# Altium project ife18_TS_BMS_LTC6813_v3.PrjPcb
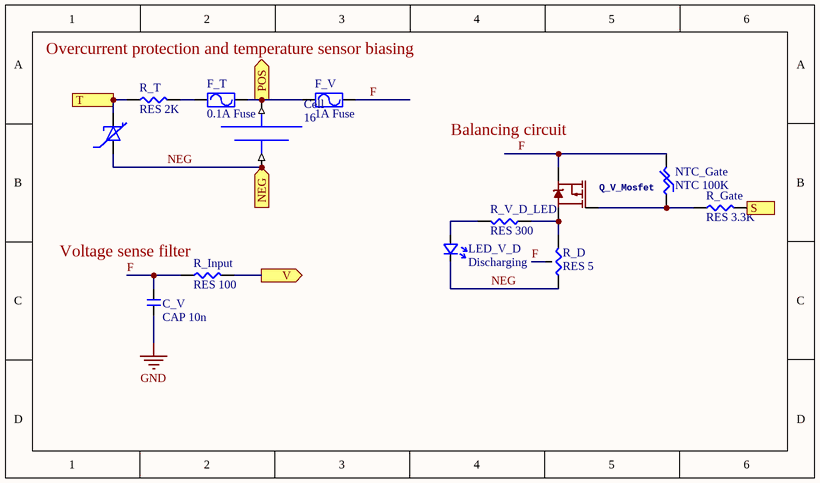
[diagram p0: Cell.SchDoc]
2 sheets, 71 parts. Net scope: hierarchical (ports join the sheet entries above them; power ports are global).
Board file: Even.PcbDoc
Sheets:
  Cell.SchDoc
  Slave.SchDoc

## Sheet Cell.SchDoc
size 152 x 88 mm

### Parts
C_V  CAP 10n  [CAP-0603]
Cell  16  [Li1x7pVTC6T_Clips]
F_T  0.1A Fuse  [2410SMD]
F_V  1A Fuse  [2410SMD]
LED_V_D  Discharging  [LED-0603]
NTC_Gate  NTC 100K  [NTC-0603]
Q_V_Mosfet  (no value)  [TO252]
R_D  RES 5  [TO252-TKH-45]
R_Gate  RES 3.3K  [RES-0603]
R_Input  RES 100  [RES-0603]
R_T  RES 2K  [RES-0603]
R_V_D_LED  RES 300  [RES-0603]

### Ports
NEG (in), POS (out), S (in), T (out), V (out)

### Nets
GND: C_V.1
F: C_V.2 F_V.1 NTC_Gate.2 Q_V_Mosfet.3(S) R_D.3 R_Input.1
NEG: Cell.- Cell.-L Cell.-O Cell.-R Cell.T- LED_V_D.K R_D.1 ; port NEG
NetCell_+: Cell.+ Cell.+L Cell.+O Cell.+R F_T.1 F_V.2 ; port POS
NetCell_T+: Cell.T+ R_T.1 ; port T
NetF_T_2: F_T.2 R_T.2
NetLED_V_D_A: LED_V_D.A R_V_D_LED.2
NetNTC_Gate_1: NTC_Gate.1 Q_V_Mosfet.1(G) R_Gate.1
NetQ_V_Mosfet_2: Q_V_Mosfet.2(D) R_D.2 R_V_D_LED.1
NetR_Gate_2: R_Gate.2 ; port S
NetR_Input_2: R_Input.2 ; port V

### Notes on the sheet
- Overcurrent protection and temperature sensor biasing
- (near Q_V_Mosfet) Balancing circuit
- (near R_Input) Voltage sense filter

### Library data of the parts
C_V = CAP-0603
Cell = Li1x7pVTC6T_Clip
F_T F_V = 0679L
LED_V_D = LED-0603
NTC_Gate = NTC-0603
Q_V_Mosfet = DMP10H400SK3-13: GateName_1: G$1; SymbolName_1: LABELED-PMOS; LibraryName: IFE_Transistors; DeviceSetName: DMP10H400SK3-13; Package: TO252
R_D = TKH45
R_Gate R_Input R_T R_V_D_LED = RES-0603

## Sheet Slave.SchDoc
size B
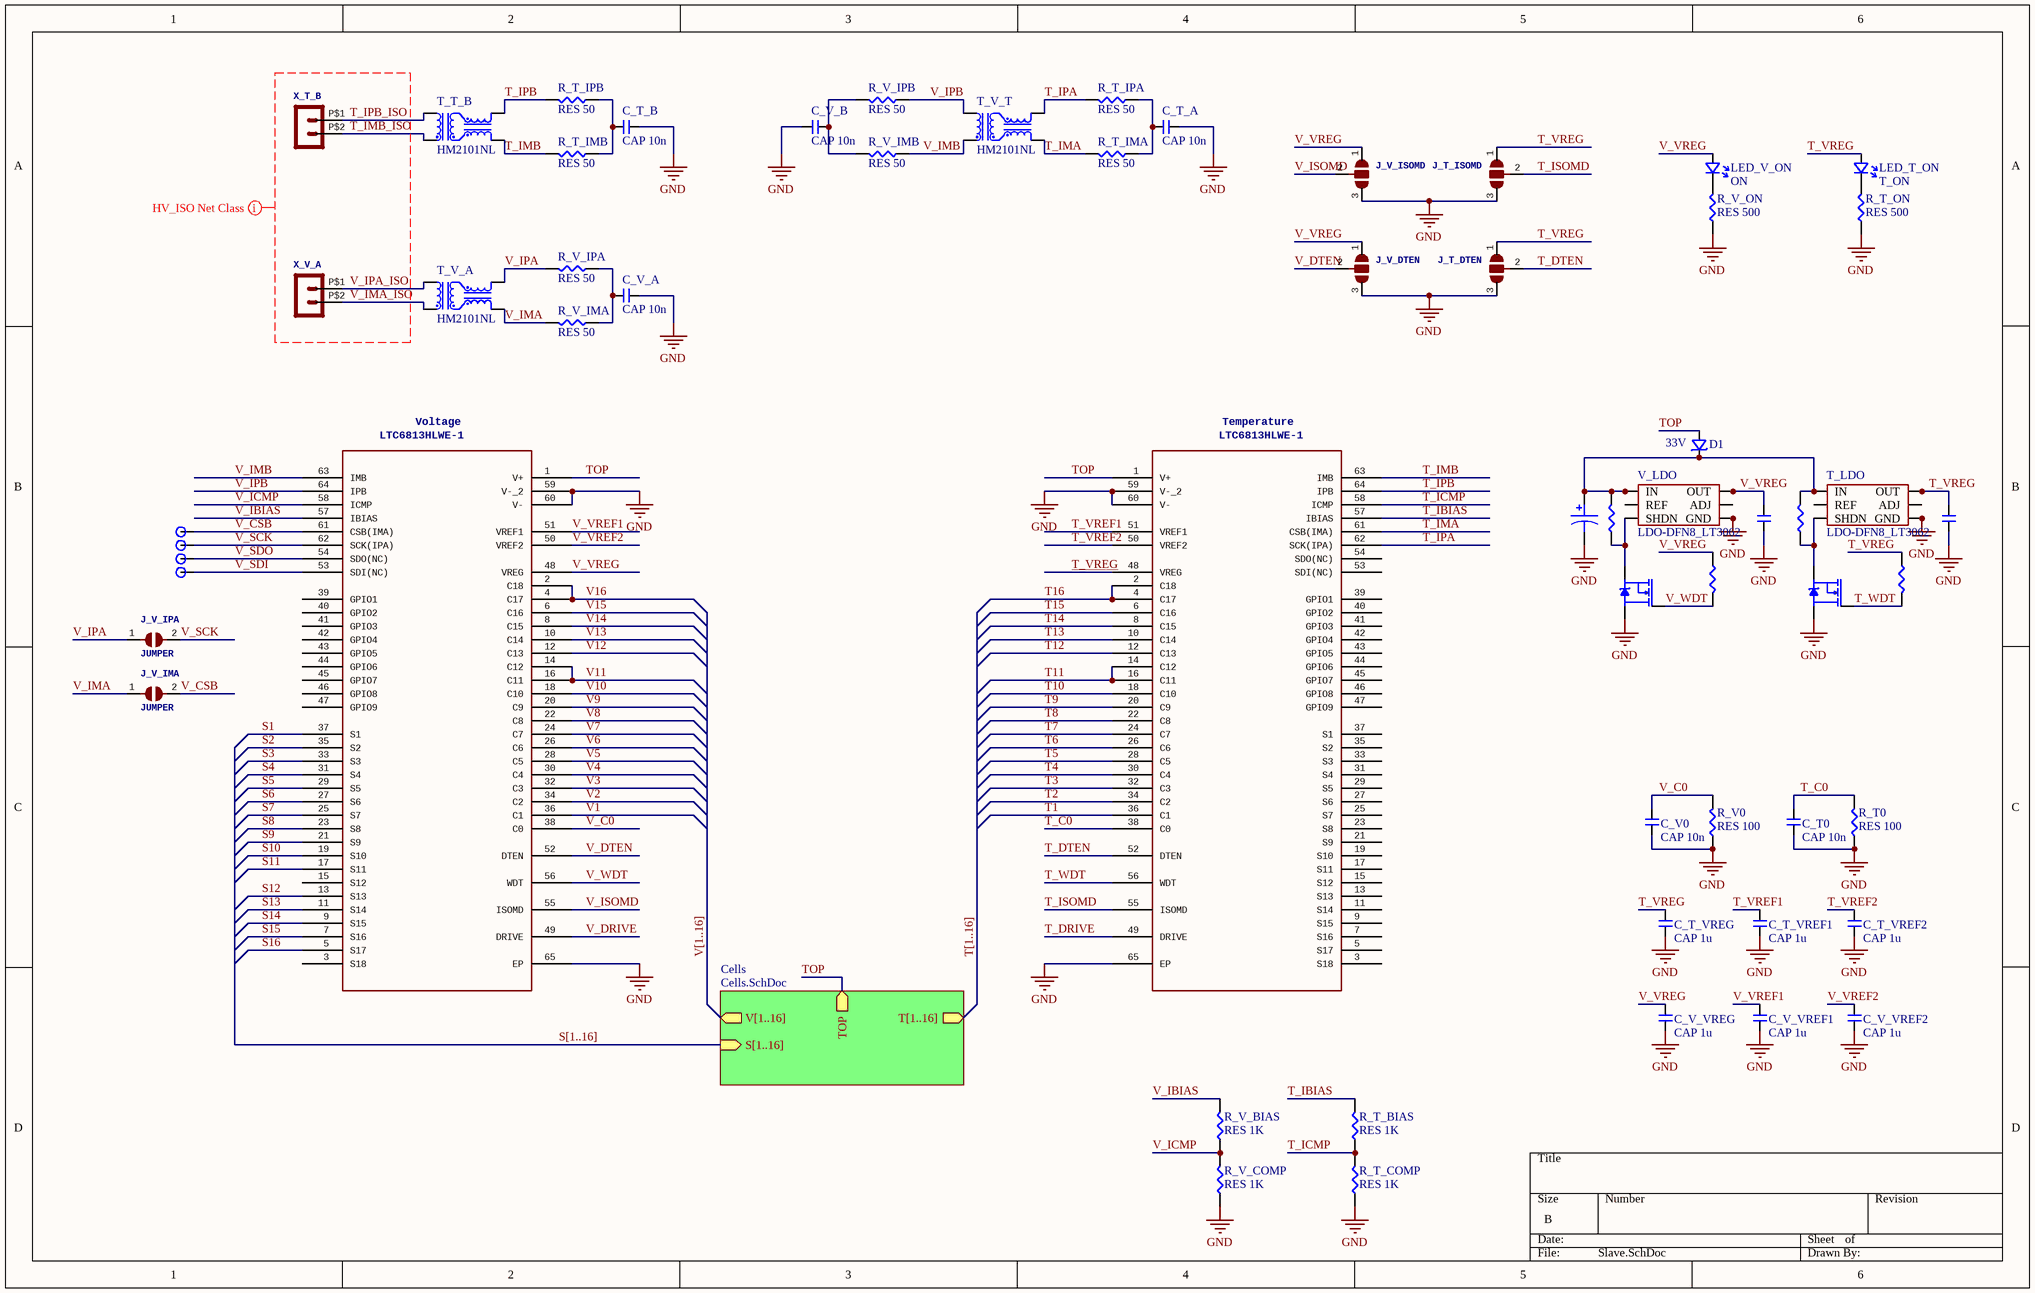
[diagram p1: Slave.SchDoc]

### Parts
C_T0  CAP 10n  [CAP-0603]
C_T_A  CAP 10n  [CAP-0603]
C_T_B  CAP 10n  [CAP-0603]
C_T_VREF1  CAP 1u  [CAP-0603]
C_T_VREF2  CAP 1u  [CAP-0603]
C_T_VREG  CAP 1u  [CAP-0603]
C_V0  CAP 10n  [CAP-0603]
C_V_A  CAP 10n  [CAP-0603]
C_V_B  CAP 10n  [CAP-0603]
C_V_VREF1  CAP 1u  [CAP-0603]
C_V_VREF2  CAP 1u  [CAP-0603]
C_V_VREG  CAP 1u  [CAP-0603]
CAP-T_VREG  10uF  [CAP-0603]  (value not drawn)
CAP-V_VREG  10uF  [CAP-0603]  (value not drawn)
CAP_TOP  10uF  [CAP-6.3D7.7H-SMD]  (value not drawn)
D1  33V  [SMB]
J_T_DTEN  (no value)  [SJ_2]
J_T_ISOMD  (no value)  [SJ_2]
J_V_DTEN  (no value)  [SJ_2]
J_V_IMA  JUMPER  [SJ]
J_V_IPA  JUMPER  [SJ]
J_V_ISOMD  (no value)  [SJ_2]
LED_T_ON  T_ON  [LED-0603]
LED_V_ON  ON  [LED-0603]
R_T0  RES 100  [RES-0603]
R_T_BIAS  RES 1K  [RES-0603]
R_T_COMP  RES 1K  [RES-0603]
R_T_IMA  RES 50  [RES-0603]
R_T_IMB  RES 50  [RES-0603]
R_T_IPA  RES 50  [RES-0603]
R_T_IPB  RES 50  [RES-0603]
R_T_ON  RES 500  [RES-0603]
R_V0  RES 100  [RES-0603]
R_V_BIAS  RES 1K  [RES-0603]
R_V_COMP  RES 1K  [RES-0603]
R_V_IMA  RES 50  [RES-0603]
R_V_IMB  RES 50  [RES-0603]
R_V_IPA  RES 50  [RES-0603]
R_V_IPB  RES 50  [RES-0603]
R_V_ON  RES 500  [RES-0603]
T_LDO  LDO-DFN8_LT3062  [DFN8]
T_LDO_NMOS  NMOS-SOT23  [SOT23]  (value not drawn)
T_LDO_NMOS_PU  100K  [RES-0603]  (value not drawn)
T_LDO_PU  10K  [RES-0603]  (value not drawn)
T_T_B  HM2101NL  [HM2101]
T_V_A  HM2101NL  [HM2101]
T_V_T  HM2101NL  [HM2101]
Temperature  LTC6813HLWE-1  [LQFP64_LWE_A]
TP_CSB  S  [Testpoint]  (value not drawn)
TP_SCK  C  [Testpoint]  (value not drawn)
TP_SDI  I  [Testpoint]  (value not drawn)
TP_SDO  O  [Testpoint]  (value not drawn)
V_LDO  LDO-DFN8_LT3062  [DFN8]
V_LDO_NMOS  NMOS-SOT23  [SOT23]  (value not drawn)
V_LDO_NMOS_PU  100K  [RES-0603]  (value not drawn)
V_LDO_PU  10K  [RES-0603]  (value not drawn)
Voltage  LTC6813HLWE-1  [LQFP64_LWE_A]
X_T_B  Molex - Micro-Fit 3.0 Series connector,  3.00mm (0.118") pitch header, 2 positions.  [43650-0224]  (value not drawn)
X_V_A  Molex - Micro-Fit 3.0 Series connector,  3.00mm (0.118") pitch header, 2 positions.  [43650-0224]  (value not drawn)

### Sub-sheets
Cells = Cells.SchDoc (file not in this document): S[1..16] (in), V[1..16] (out), T[1..16] (out), TOP (out)

### Nets
GND: C_T0.1 C_T_A.1 C_T_B.1 C_T_VREF1.1 C_T_VREF2.1 C_T_VREG.1 C_V0.1 C_V_A.1 C_V_B.1 C_V_VREF1.1 C_V_VREF2.1 C_V_VREG.1 CAP-T_VREG.1 CAP-V_VREG.1 CAP_TOP.NEG(-) J_T_DTEN.3 J_T_ISOMD.3 J_V_DTEN.3 J_V_ISOMD.3 R_T0.1 R_T_COMP.1 R_T_ON.1 R_V0.1 R_V_COMP.1 R_V_ON.1 T_LDO.8(GND) T_LDO.EP(GND) T_LDO_NMOS.2(S) Temperature.59(V-_2) Temperature.60(V-) Temperature.65(EP) V_LDO.8(GND) V_LDO.EP(GND) V_LDO_NMOS.2(S) Voltage.59(V-_2) Voltage.60(V-) Voltage.65(EP)
S1: Voltage.37(S1)
S2: Voltage.35(S2)
S3: Voltage.33(S3)
S4: Voltage.31(S4)
S5: Voltage.29(S5)
S6: Voltage.27(S6)
S7: Voltage.25(S7)
S8: Voltage.23(S8)
S9: Voltage.21(S9)
S10: Voltage.19(S10)
S11: Voltage.17(S11)
S12: Voltage.13(S13)
S13: Voltage.11(S14)
S14: Voltage.9(S15)
S15: Voltage.7(S16)
S16: Voltage.5(S17)
T1: Temperature.36(C1)
T2: Temperature.34(C2)
T3: Temperature.32(C3)
T4: Temperature.30(C4)
T5: Temperature.28(C5)
T6: Temperature.26(C6)
T7: Temperature.24(C7)
T8: Temperature.22(C8)
T9: Temperature.20(C9)
T10: Temperature.18(C10)
T11: Temperature.14(C12) Temperature.16(C11)
T12: Temperature.12(C13)
T13: Temperature.10(C14)
T14: Temperature.8(C15)
T15: Temperature.6(C16)
T16: Temperature.2(C18) Temperature.4(C17)
T_C0: C_T0.2 R_T0.2 Temperature.38(C0)
T_DRIVE: Temperature.49(DRIVE)
T_DTEN: J_T_DTEN.2 Temperature.52(DTEN)
T_IBIAS: R_T_BIAS.2 Temperature.57(IBIAS)
T_ICMP: R_T_BIAS.1 R_T_COMP.2 Temperature.58(ICMP)
T_IMA: R_T_IMA.2 T_V_T.4 Temperature.61(CSB(IMA))
T_IMB: R_T_IMB.2 T_T_B.4 Temperature.63(IMB)
T_IMB_ISO: T_T_B.3 X_T_B.P$2
T_IPA: R_T_IPA.2 T_V_T.6 Temperature.62(SCK(IPA))
T_IPB: R_T_IPB.2 T_T_B.6 Temperature.64(IPB)
T_IPB_ISO: T_T_B.1 X_T_B.P$1
T_ISOMD: J_T_ISOMD.2 Temperature.55(ISOMD)
T_VREF1: C_T_VREF1.2 Temperature.51(VREF1)
T_VREF2: C_T_VREF2.2 Temperature.50(VREF2)
T_VREG: C_T_VREG.2 CAP-T_VREG.2 J_T_DTEN.1 J_T_ISOMD.1 LED_T_ON.A T_LDO.3(OUT) T_LDO.4(OUT) T_LDO_NMOS_PU.1 Temperature.48(VREG)
T_WDT: T_LDO_NMOS.1(G) T_LDO_NMOS_PU.2 Temperature.56(WDT)
TOP: D1.A Temperature.1(V+) Voltage.1(V+) ; sheet Cells/TOP
V1: Voltage.36(C1)
V2: Voltage.34(C2)
V3: Voltage.32(C3)
V4: Voltage.30(C4)
V5: Voltage.28(C5)
V6: Voltage.26(C6)
V7: Voltage.24(C7)
V8: Voltage.22(C8)
V9: Voltage.20(C9)
V10: Voltage.18(C10)
V11: Voltage.14(C12) Voltage.16(C11)
V12: Voltage.12(C13)
V13: Voltage.10(C14)
V14: Voltage.8(C15)
V15: Voltage.6(C16)
V16: Voltage.2(C18) Voltage.4(C17)
V_C0: C_V0.2 R_V0.2 Voltage.38(C0)
V_CSB: J_V_IMA.2 TP_CSB.1 Voltage.61(CSB(IMA))
V_DRIVE: Voltage.49(DRIVE)
V_DTEN: J_V_DTEN.2 Voltage.52(DTEN)
V_IBIAS: R_V_BIAS.2 Voltage.57(IBIAS)
V_ICMP: R_V_BIAS.1 R_V_COMP.2 Voltage.58(ICMP)
V_IMA: J_V_IMA.1 R_V_IMA.2 T_V_A.4
V_IMA_ISO: T_V_A.3 X_V_A.P$2
V_IMB: R_V_IMB.2 T_V_T.3 Voltage.63(IMB)
V_IPA: J_V_IPA.1 R_V_IPA.2 T_V_A.6
V_IPA_ISO: T_V_A.1 X_V_A.P$1
V_IPB: R_V_IPB.2 T_V_T.1 Voltage.64(IPB)
V_ISOMD: J_V_ISOMD.2 Voltage.55(ISOMD)
V_SCK: J_V_IPA.2 TP_SCK.1 Voltage.62(SCK(IPA))
V_SDI: TP_SDI.1 Voltage.53(SDI(NC))
V_SDO: TP_SDO.1 Voltage.54(SDO(NC))
V_VREF1: C_V_VREF1.2 Voltage.51(VREF1)
V_VREF2: C_V_VREF2.2 Voltage.50(VREF2)
V_VREG: C_V_VREG.2 CAP-V_VREG.2 J_V_DTEN.1 J_V_ISOMD.1 LED_V_ON.A V_LDO.3(OUT) V_LDO.4(OUT) V_LDO_NMOS_PU.1 Voltage.48(VREG)
V_WDT: V_LDO_NMOS.1(G) V_LDO_NMOS_PU.2 Voltage.56(WDT)
NetC_T_A_2: C_T_A.2 R_T_IMA.1 R_T_IPA.1
NetC_T_B_2: C_T_B.2 R_T_IMB.1 R_T_IPB.1
NetC_V_A_2: C_V_A.2 R_V_IMA.1 R_V_IPA.1
NetC_V_B_2: C_V_B.2 R_V_IMB.1 R_V_IPB.1
NetCAP_TOP_POS: CAP_TOP.POS(+) D1.K T_LDO.5(IN) T_LDO.6(IN) T_LDO_PU.2 V_LDO.5(IN) V_LDO.6(IN) V_LDO_PU.2
NetLED_T_ON_K: LED_T_ON.K R_T_ON.2
NetLED_V_ON_K: LED_V_ON.K R_V_ON.2
NetT_LDO_7: T_LDO.7(SHDN) T_LDO_NMOS.3(D) T_LDO_PU.1
NetV_LDO_7: V_LDO.7(SHDN) V_LDO_NMOS.3(D) V_LDO_PU.1

Not connected (* = marked no-connect by the designer): T_LDO 1(REF) 2(ADJ); Temperature 3(S18) 5(S17) 7(S16) 9(S15) 11(S14) 13(S13) 15(S12) 17(S11) 19(S10) 21(S9) 23(S8) 25(S7) 27(S6) 29(S5) 31(S4) 33(S3) 35(S2) 37(S1) 39(GPIO1) 40(GPIO2) 41(GPIO3) 42(GPIO4) 43(GPIO5) 44(GPIO6) 45(GPIO7) 46(GPIO8) 47(GPIO9) 53(SDI(NC)) 54(SDO(NC)); V_LDO 1(REF) 2(ADJ); Voltage 3(S18) 15(S12) 39(GPIO1) 40(GPIO2) 41(GPIO3) 42(GPIO4) 43(GPIO5) 44(GPIO6) 45(GPIO7) 46(GPIO8) 47(GPIO9)

### Buses and harness runs
bus S[1..16] = sheet Cells/S[1..16]
bus T[1..16] = sheet Cells/T[1..16]
bus V[1..16] = sheet Cells/V[1..16]

### Layout directives
net class HV_ISO: T_IMB_ISO, T_IPB_ISO, V_IMA_ISO, V_IPA_ISO

### Library data of the parts
C_T0 C_T_A C_T_B C_T_VREF1 C_T_VREF2 C_T_VREG C_V0 C_V_A C_V_B C_V_VREF1 C_V_VREF2 C_V_VREG CAP-T_VREG CAP-V_VREG = CAP-0603
CAP_TOP = CAP-6.3D7.7H-SMD
D1 = DIODE-SMB
J_T_DTEN J_T_ISOMD J_V_DTEN J_V_ISOMD = JUMPER_2W: GateName_1: G$1; SymbolName_1: SJ_2; LibraryName: IFE_Jumpers; DeviceSetName: JUMPER_2W; Package: SJ_2
J_V_IMA J_V_IPA = JUMPER: GateName_1: G$1; SymbolName_1: SJ; LibraryName: IFE_Jumpers; DeviceSetName: JUMPER; Package: SJ
LED_T_ON LED_V_ON = LED-0603
R_T0 R_T_BIAS R_T_COMP R_T_IMA R_T_IMB R_T_IPA R_T_IPB R_T_ON R_V0 R_V_BIAS R_V_COMP R_V_IMA R_V_IMB R_V_IPA R_V_IPB R_V_ON T_LDO_NMOS_PU T_LDO_PU V_LDO_NMOS_PU V_LDO_PU = RES-0603
Temperature Voltage = LTC6813HLWE-1: GateName_1: A; SymbolName_1: LTC6813XLWE-1; LibraryName: LTC6813_Official; DeviceSetName: LTC6813HLWE-1; Package: LQFP64_LWE_A
TP_CSB TP_SCK TP_SDI TP_SDO = Testpoint
X_T_B X_V_A = HEADER_POS2_?43650-0224: GateName_1: G$1; SymbolName_1: HEADER_POS2; DeviceName: 43650-0224; LibraryName: MOLEX Micro-Fit; DeviceSetName: HEADER_POS2_?; Package: 43650-0224

## Nets that join several sheets
GND: Cell (C_V.1), Slave (37 pins)